# Altium schematic sheet MdA_Perifericos.SchDoc: **
size A4; Author: **; CompanyName: Introducción al Diseño de Circuitos Impresos; Organization: UTN FRBA; Revision: **; SheetNumber: 3; SheetTotal: 4
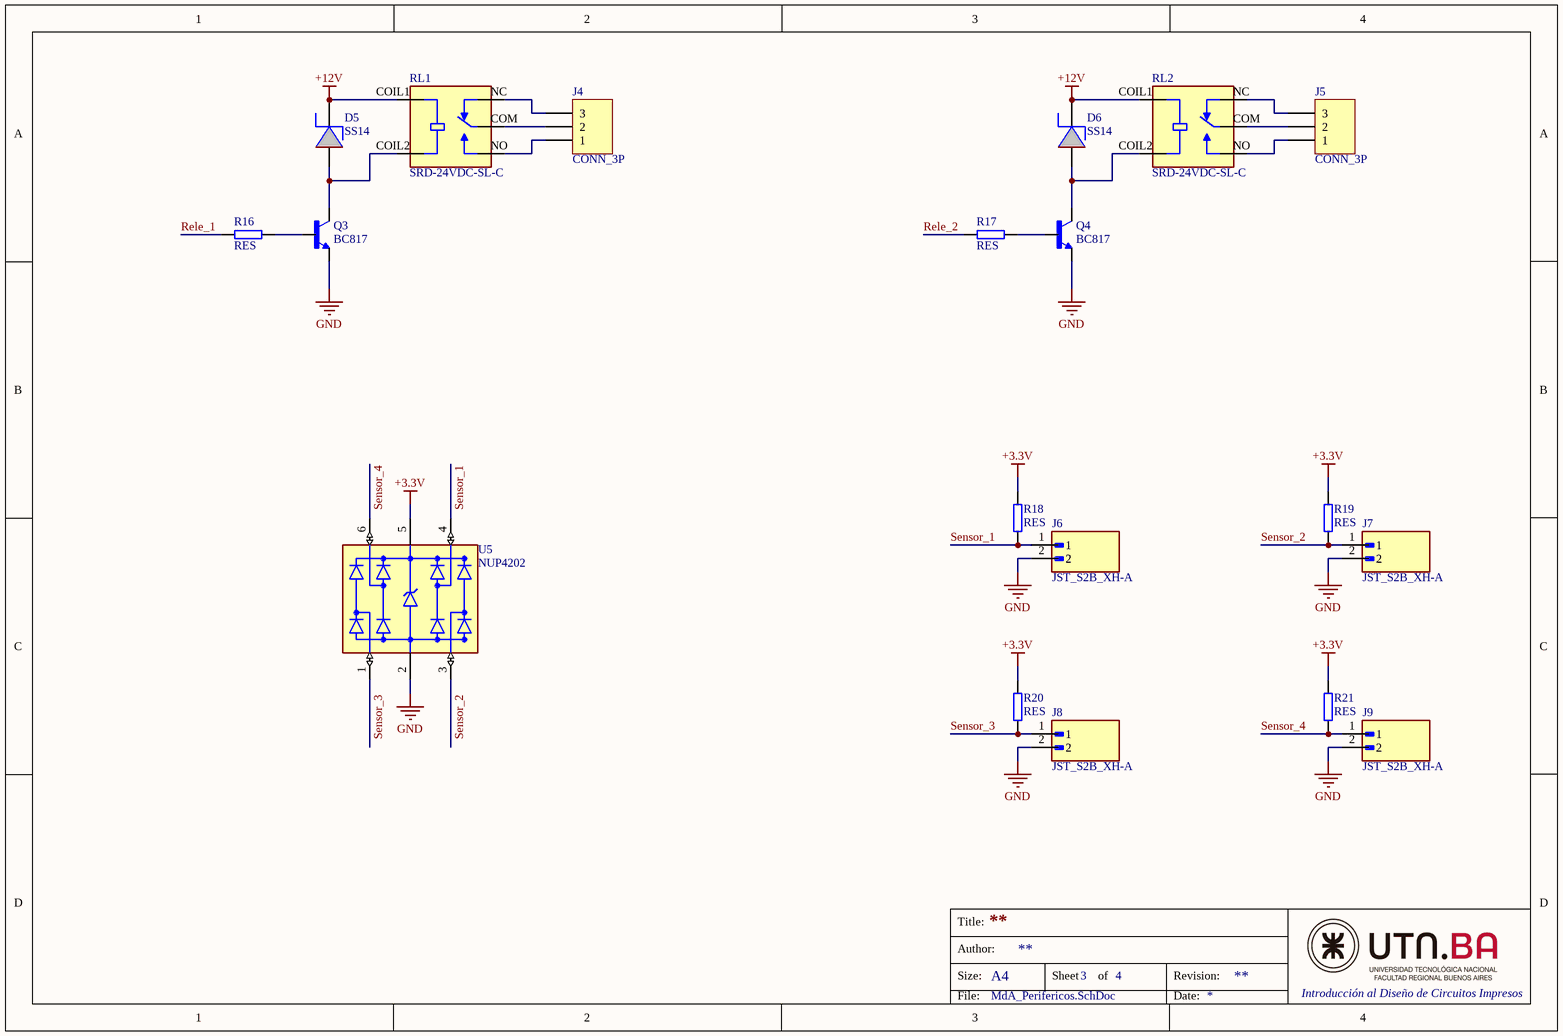
[diagram p0: MdA_Perifericos.SchDoc]

## Parts
D5  SS14  [D_SMA]
D6  SS14  [D_SMA]
J4  CONN_3P  [BORNERA_3P_P_5mm]
J5  CONN_3P  [BORNERA_3P_P_5mm]
J6  JST_S2B_XH-A  [JST_S2B-XH-A]
J7  JST_S2B_XH-A  [JST_S2B-XH-A]
J8  JST_S2B_XH-A  [JST_S2B-XH-A]
J9  JST_S2B_XH-A  [JST_S2B-XH-A]
Q3  BC817  [SOT-23-3]
Q4  BC817  [SOT-23-3]
R16  RES  [R_0402]
R17  RES  [R_0402]
R18  RES  [R_0402]
R19  RES  [R_0402]
R20  RES  [R_0402]
R21  RES  [R_0402]
RL1  SRD-24VDC-SL-C  [RELAY_SRD-24VDC-SL-C]
RL2  SRD-24VDC-SL-C  [RELAY_SRD-24VDC-SL-C]
U5  NUP4202  [SOT-363]

## Nets
+3.3V: R18.1 R19.1 R20.1 R21.1 U5.5(VDD)
+12V: D5.2(K) D6.2(K) RL1.COIL1 RL2.COIL1
GND: J6.2 J7.2 J8.2 J9.2 Q3.2(E) Q4.2(E) U5.2(GND)
Rele_1: R16.1
Rele_2: R17.1
Sensor_1: J6.1 R18.2 U5.4(IO3)
Sensor_2: J7.1 R19.2 U5.3(IO2)
Sensor_3: J8.1 R20.2 U5.1(IO1)
Sensor_4: J9.1 R21.2 U5.6(IO4)
NetD5_1: D5.1(A) Q3.3(C) RL1.COIL2
NetD6_1: D6.1(A) Q4.3(C) RL2.COIL2
NetJ4_1: J4.1 RL1.NO
NetJ4_2: J4.2 RL1.COM
NetJ4_3: J4.3 RL1.NC
NetJ5_1: J5.1 RL2.NO
NetJ5_2: J5.2 RL2.COM
NetJ5_3: J5.3 RL2.NC
NetQ3_1: Q3.1(B) R16.2
NetQ4_1: Q4.1(B) R17.2

## Notes on the sheet
- Title:
- Size:
- Author:
- A4
- Sheet
- of
- Revision:
- File:
- Date:

## Library data of the parts
D5 D6 = DIODE_SH